# EAGLE design TH_PROBE (EAGLE 9.6.2)
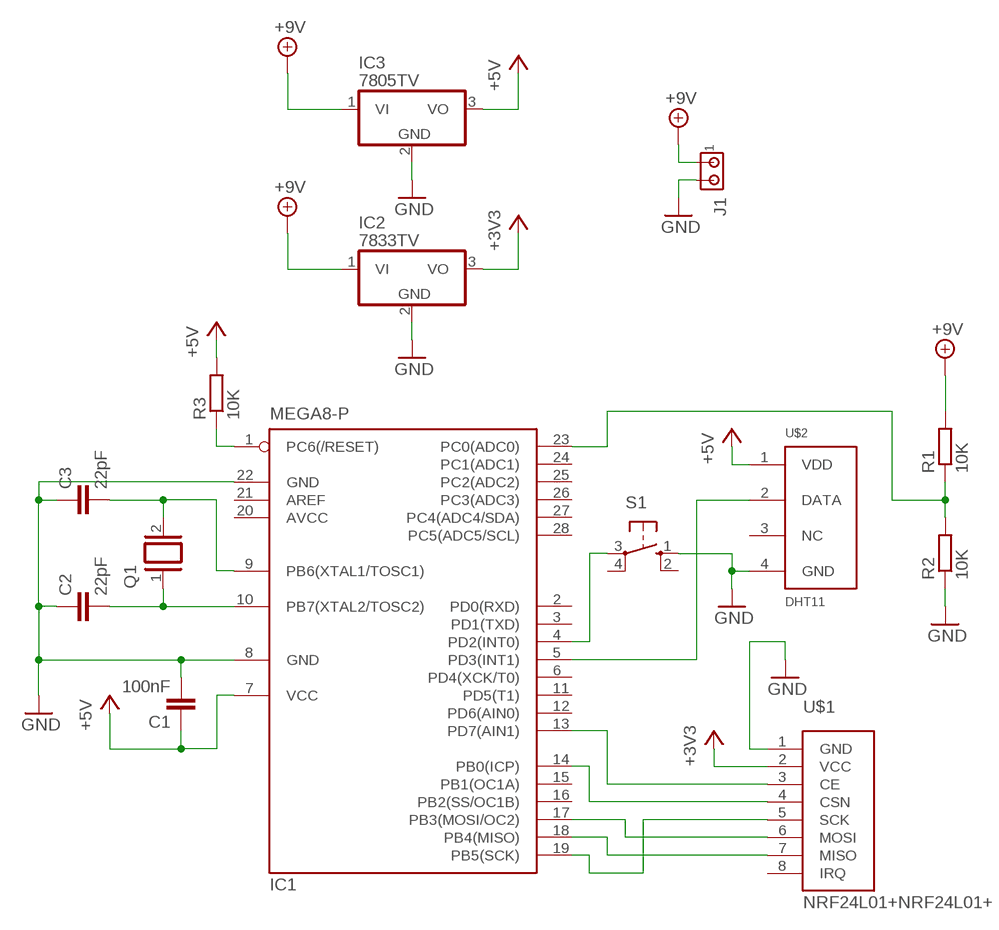
[diagram p0: schematic, sheet 1]

## Parts
C1  100nF  C-EU025-025X050  [C025-025X050]
C2  22pF  C-EU025-025X050  [C025-025X050]
C3  22pF  C-EU025-025X050  [C025-025X050]
IC1  MEGA8-P  [DIL28-3]
IC2  7833TV  7812TV  [TO220V]
IC3  7805TV  7812TV  [TO220V]
J1  MTA02-100  [10X02MTA]
Q1  XTAL/S  [QS]
R1  10K  R-EU_0204/7  [0204/7]
R2  10K  R-EU_0204/7  [0204/7]
R3  10K  R-EU_0204/7  [0204/7]
S1  10-XX  [B3F-10XX]
U$1  NRF24L01+NRF24L01+  [NRF24L01+]
U$2  DHT11  [DHT11]

## Nets
+3V3: IC2.3(VO) U$1.2(VCC)
+5V: C1.1 IC1.7(VCC) IC3.3(VO) R3.2 U$2.1(VDD)
+9V: IC2.1(VI) IC3.1(VI) J1.1 R1.2
GND: C1.2 C2.1 C3.1 IC1.8(GND) IC1.22(GND) IC2.2(GND) IC3.2(GND) J1.2 R2.1 S1.1(S) U$1.1(GND) U$2.4(GND)
N$1: IC1.17(PB3(MOSI/OC2)) U$1.6(MOSI)
N$2: IC1.18(PB4(MISO)) U$1.7(MISO)
N$3: C2.2 IC1.10(PB7(XTAL2/TOSC2)) Q1.1
N$4: C3.2 IC1.9(PB6(XTAL1/TOSC1)) Q1.2
N$5: IC1.19(PB5(SCK)) U$1.5(SCK)
N$6: IC1.13(PD7(AIN1)) U$1.3(CE)
N$7: IC1.14(PB0(ICP)) U$1.4(CSN)
N$8: IC1.5(PD3(INT1)) U$2.2(DATA)
N$9: IC1.23(PC0(ADC0)) R1.1 R2.2
N$10: IC1.4(PD2(INT0)) S1.3(P)
N$11: IC1.1(PC6(/RESET)) R3.1
Unconnected: IC1.2(PD0(RXD)) IC1.3(PD1(TXD)) IC1.6(PD4(XCK/T0)) IC1.11(PD5(T1)) IC1.12(PD6(AIN0)) IC1.15(PB1(OC1A)) IC1.16(PB2(SS/OC1B)) IC1.21(AREF) IC1.24(PC1(ADC1)) IC1.25(PC2(ADC2)) IC1.26(PC3(ADC3)) IC1.27(PC4(ADC4/SDA)) IC1.28(PC5(ADC5/SCL)) S1.2(S1) S1.4(P1) U$1.8(IRQ) U$2.3(NC)

## Power pins joined to a net without a drawn wire
AVCC: IC1.20(AVCC)

## Library data of the parts
C1-C3 = rcl:C-EU: CAPACITOR, European symbol; SPICEPREFIX: C
IC1 = atmel:MEGA8-P: MICROCONTROLLER 8 Kbytes FLASH, 1 kbytes SRAM, 512 bytes EEPROM, USART, 4-channel 10 bit ADC, 2-channel 8 bit ADC Pin compatible with Atmega48, ATMega88, ATMega168 Source: avr.lbr; OC_FARNELL: unknown; OC_NEWARK: unknown
IC2 IC3 = linear:78*: Positive VOLTAGE REGULATOR Source: http://cache.national.com/ds/LM/LM78L05.pdf http://www.fairchildsemi.com/ds/LM/LM7805.pdf
J1 = con-amp:MTA02-100: AMP connector
Q1 = special:XTAL/S: CRYSTAL
R1-R3 = rcl:R-EU_: RESISTOR, European symbol; SPICEPREFIX: R
S1 = switch-omron:10-XX: OMRON SWITCH; MPN: B3F-1000; OC_FARNELL: 176432; OC_NEWARK: 36M3542
U$1 = nRF24l01+:NRF24L01+
U$2 = dth:DHT11

## Board
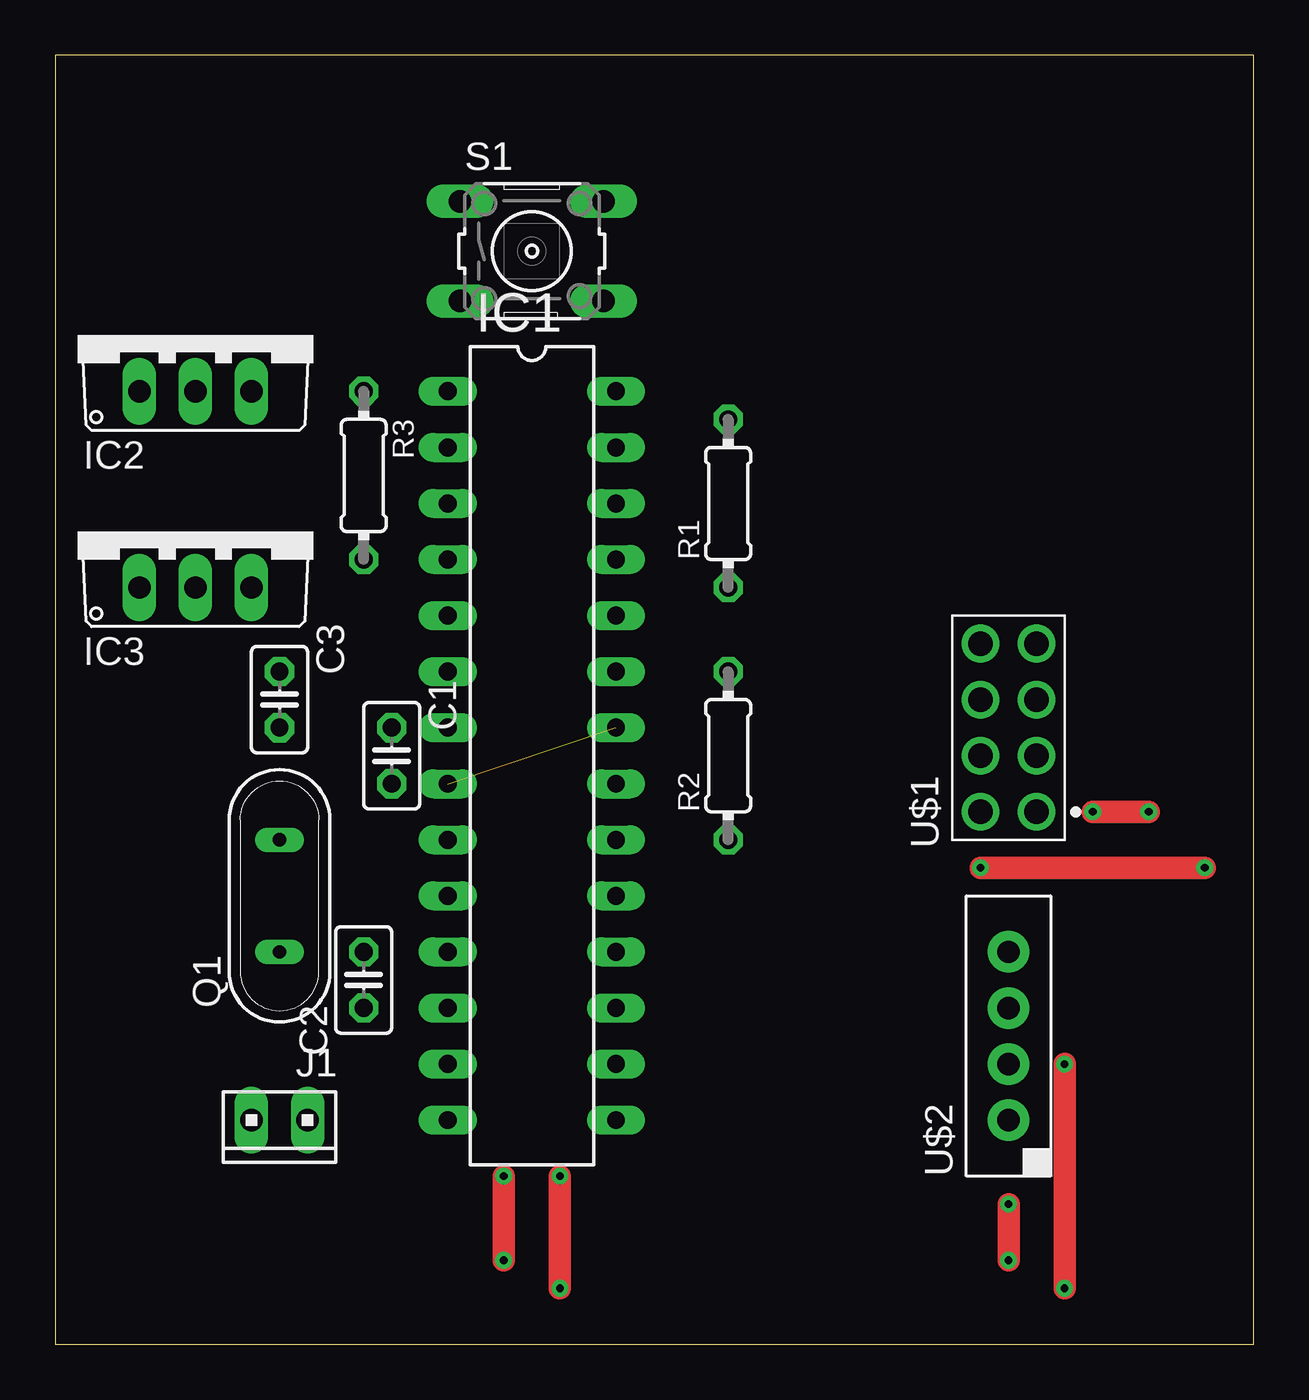
[diagram p1: board, top side]
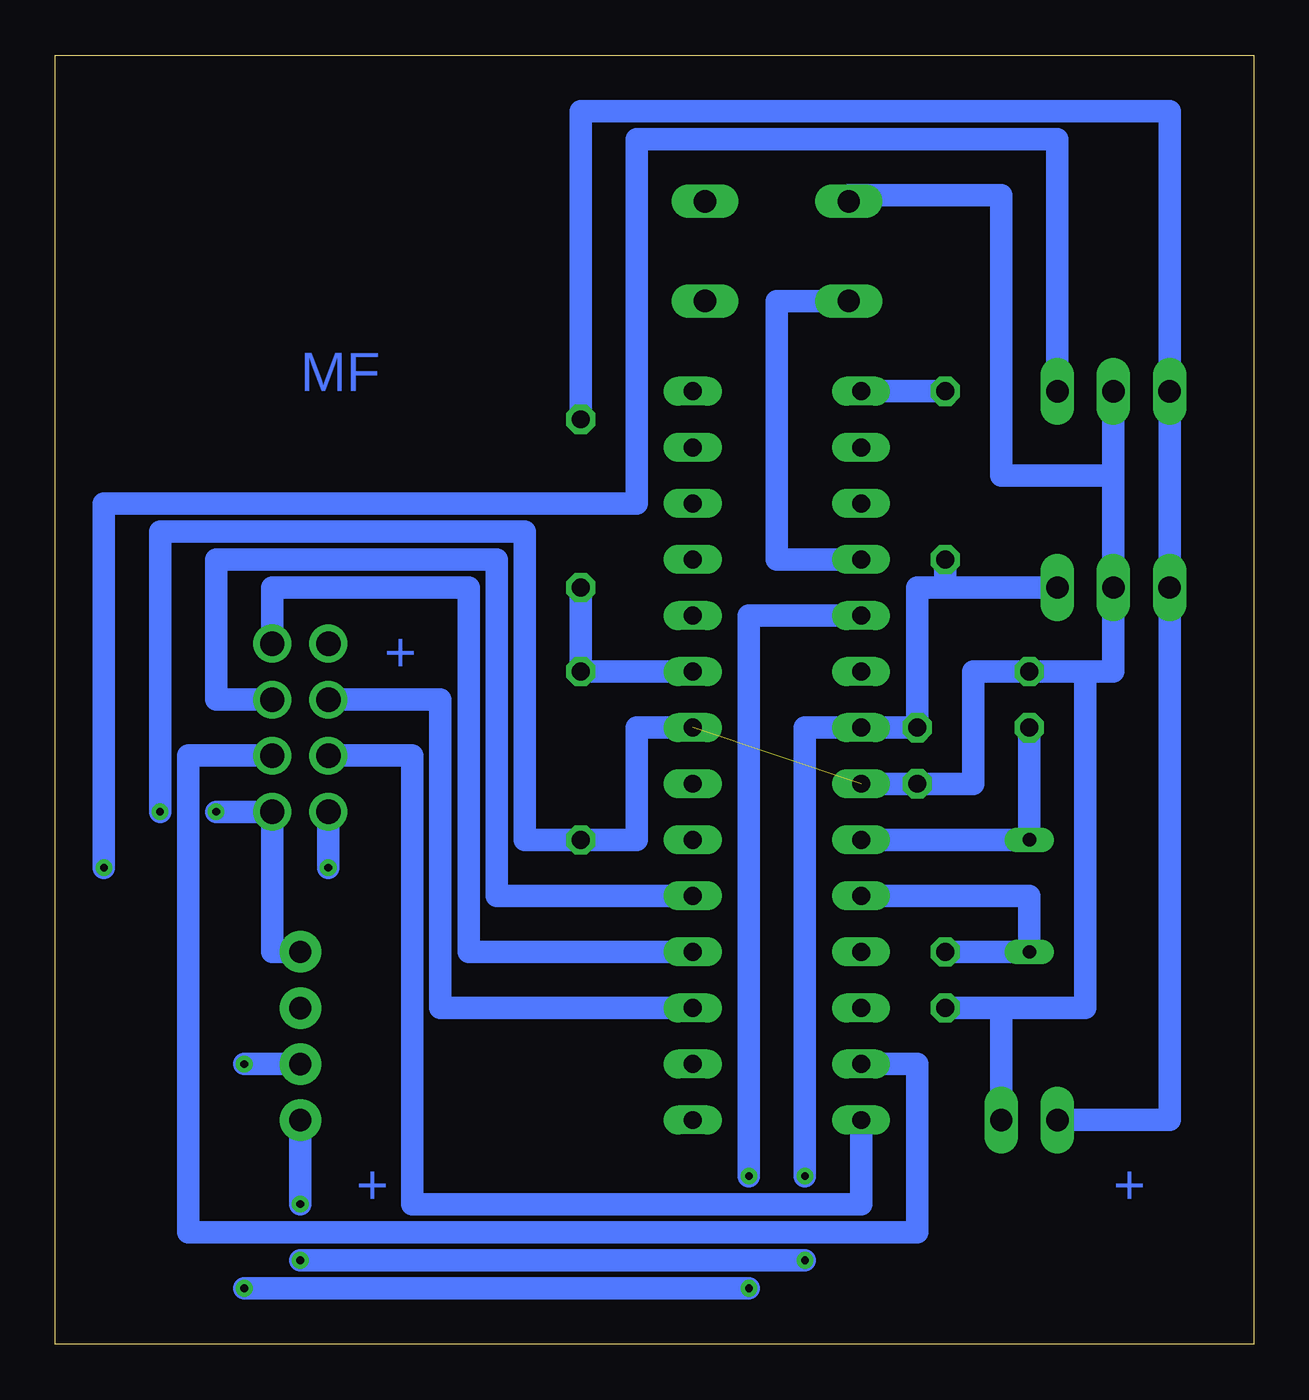
[diagram p2: board, bottom side, seen from below]

Size 54.28 x 58.41 mm. Coordinates in mm from the lower left corner, seen from the top.
Outline: 0,0 54.28,0 54.28,58.41 0,58.41 0,0
Copper layers (1*16): Top 0.035mm / dielectric 1.5mm / Bottom 0.035mm
Design rules "default": minimum track width 6mil, minimum drill 0.35mm, track to track 6mil, track to pad 6mil, pad to pad 6mil, via to via 6mil, smd to smd 6mil, copper to edge 40mil, drill to drill 6mil, minimum pad ring 10mil, minimum via ring 8mil, stop-mask expansion 4mil, vias tented up to drill 0mil, thermal gap 10mil

### Footprints (pad centres in the part's own frame; a part is rotated, then mirrored left to right if it is on the bottom)
C025-025X050 = drill 0.813 octagon: 1 -1.27,0; 2 1.27,0
DIL28-3 = drill 0.813 long: 1 -16.51,-3.81; 2 -13.97,-3.81; 3 -11.43,-3.81; 4 -8.89,-3.81; 5 -6.35,-3.81; 6 -3.81,-3.81; 7 -1.27,-3.81; 8 1.27,-3.81; 9 3.81,-3.81; 10 6.35,-3.81; 11 8.89,-3.81; 12 11.43,-3.81; 13 13.97,-3.81; 14 16.51,-3.81; 15 16.51,3.81; 16 13.97,3.81; 17 11.43,3.81; 18 8.89,3.81; 19 6.35,3.81; 20 3.81,3.81; 21 1.27,3.81; 22 -1.27,3.81; 23 -3.81,3.81; 24 -6.35,3.81; 25 -8.89,3.81; 26 -11.43,3.81; 27 -13.97,3.81; 28 -16.51,3.81
TO220V = drill 1.016 long: 1 -2.54,-2.54; 2 0,-2.54; 3 2.54,-2.54
10X02MTA = drill 1.016 long: 1 1.27,0; 2 -1.27,0
QS = drill 0.61 long: 1 -2.54,0; 2 2.54,0
0204/7 = drill 0.813 octagon: 1 -3.81,0; 2 3.81,0
B3F-10XX = drill 1.016 long: 1 -3.251,2.261; 2 3.251,2.261; 3 -3.251,-2.261; 4 3.251,-2.261
NRF24L01+ = drill 1.105 pad 1.705: 1 0,0; 2 0,2.54; 3 2.54,0; 4 2.54,2.54; 5 5.08,0; 6 5.08,2.54; 7 7.62,0; 8 7.62,2.54
DHT11 = drill 1.016 pad 1.88: 1 -3.81,0; 2 -1.27,0; 3 1.27,0; 4 3.81,0

### Placement (x,y rotation side)
C1  15.24,26.67 270 top
C2  13.97,16.51 90 top
C3  10.16,29.21 270 top
IC1  21.59,26.67 270 top
IC2  6.35,45.72 0 top
IC3  6.35,36.83 0 top
J1  10.16,10.16 180 top
Q1  10.16,20.32 90 top
R1  30.48,38.1 90 top
R2  30.48,26.67 90 top
R3  13.97,39.37 270 top
S1  21.59,49.53 0 top
U$1  44.45,24.13 90 top
U$2  43.18,13.97 90 top

### Tracks (layer width: path | path; a pad name or v marks a point on that pad's centre or on a via)
+3V3  (via drill 0.35)
  Top 1.016: v52.07,21.59 v41.91,21.59
  Bottom 1.016: IC2.3 8.89,54.61 27.94,54.61 27.94,38.1 52.07,38.1 v52.07,21.59 | U$1.2 v41.91,21.59
+5V  (via drill 0.35)
  Top 1.016: v20.32,3.81 v20.32,7.62 | v43.18,3.81 v43.18,6.35
  Bottom 1.016: 13.97,34.29 15.24,34.29 C1.1 IC1.7 20.32,27.94 v20.32,7.62 | 13.97,34.29 IC3.3 | v43.18,3.81 v20.32,3.81 | U$2.1 v43.18,6.35 | R3.2 13.97,34.29
+9V
  Bottom 1.016: R1.2 30.48,55.88 3.81,55.88 IC2.1 IC3.1 3.81,10.16 J1.1
GND  (via drill 0.35)  (1 unrouted)
  Top 1.016: v46.99,24.13 v49.53,24.13
  Bottom 1.016: U$2.4 44.45,17.78 U$1.1 v46.99,24.13 | IC1.8 C1.2 12.7,25.4 12.7,30.48 C3.1 7.62,30.48 | IC2.2 6.35,39.37 | 6.35,39.37 IC3.2 6.35,30.48 7.62,30.48 | IC1.22 27.94,27.94 27.94,22.86 R2.1 33.02,22.86 33.02,36.83 49.53,36.83 v49.53,24.13 | C2.1 11.43,15.24 | 11.43,15.24 J1.2 | 7.62,30.48 7.62,15.24 11.43,15.24 | 6.35,39.37 11.43,39.37 11.43,52.07 18.34,52.07 S1.1
N$1
  Bottom 1.016: IC1.17 36.83,15.24 36.83,29.21 U$1.6
N$2
  Bottom 1.016: U$1.7 44.45,34.29 35.56,34.29 35.56,17.78 IC1.18
N$3
  Bottom 1.016: IC1.10 10.16,20.32 Q1.1 C2.2
N$4
  Bottom 1.016: IC1.9 Q1.2 C3.2
N$5
  Bottom 1.016: U$1.5 46.99,29.21 46.99,35.56 34.29,35.56 34.29,20.32 IC1.19
N$6
  Bottom 1.016: U$1.3 48.26,26.67 48.26,5.08 15.24,5.08 15.24,12.7 IC1.13
N$7
  Bottom 1.016: U$1.4 38.1,26.67 38.1,6.35 17.78,6.35 IC1.14
N$8  (via drill 0.35)
  Top 1.016: v22.86,7.62 v22.86,2.54 | v45.72,12.7 v45.72,2.54
  Bottom 1.016: v45.72,2.54 v22.86,2.54 | v45.72,12.7 U$2.2 | v22.86,7.62 22.86,33.02 IC1.5
N$9
  Bottom 1.016: IC1.23 R2.2 R1.1
N$10
  Bottom 1.016: S1.3 21.59,47.27 21.59,35.56 IC1.4
N$11
  Bottom 1.016: R3.1 IC1.1

### Text on the board
Bottom: MF | + | + | +